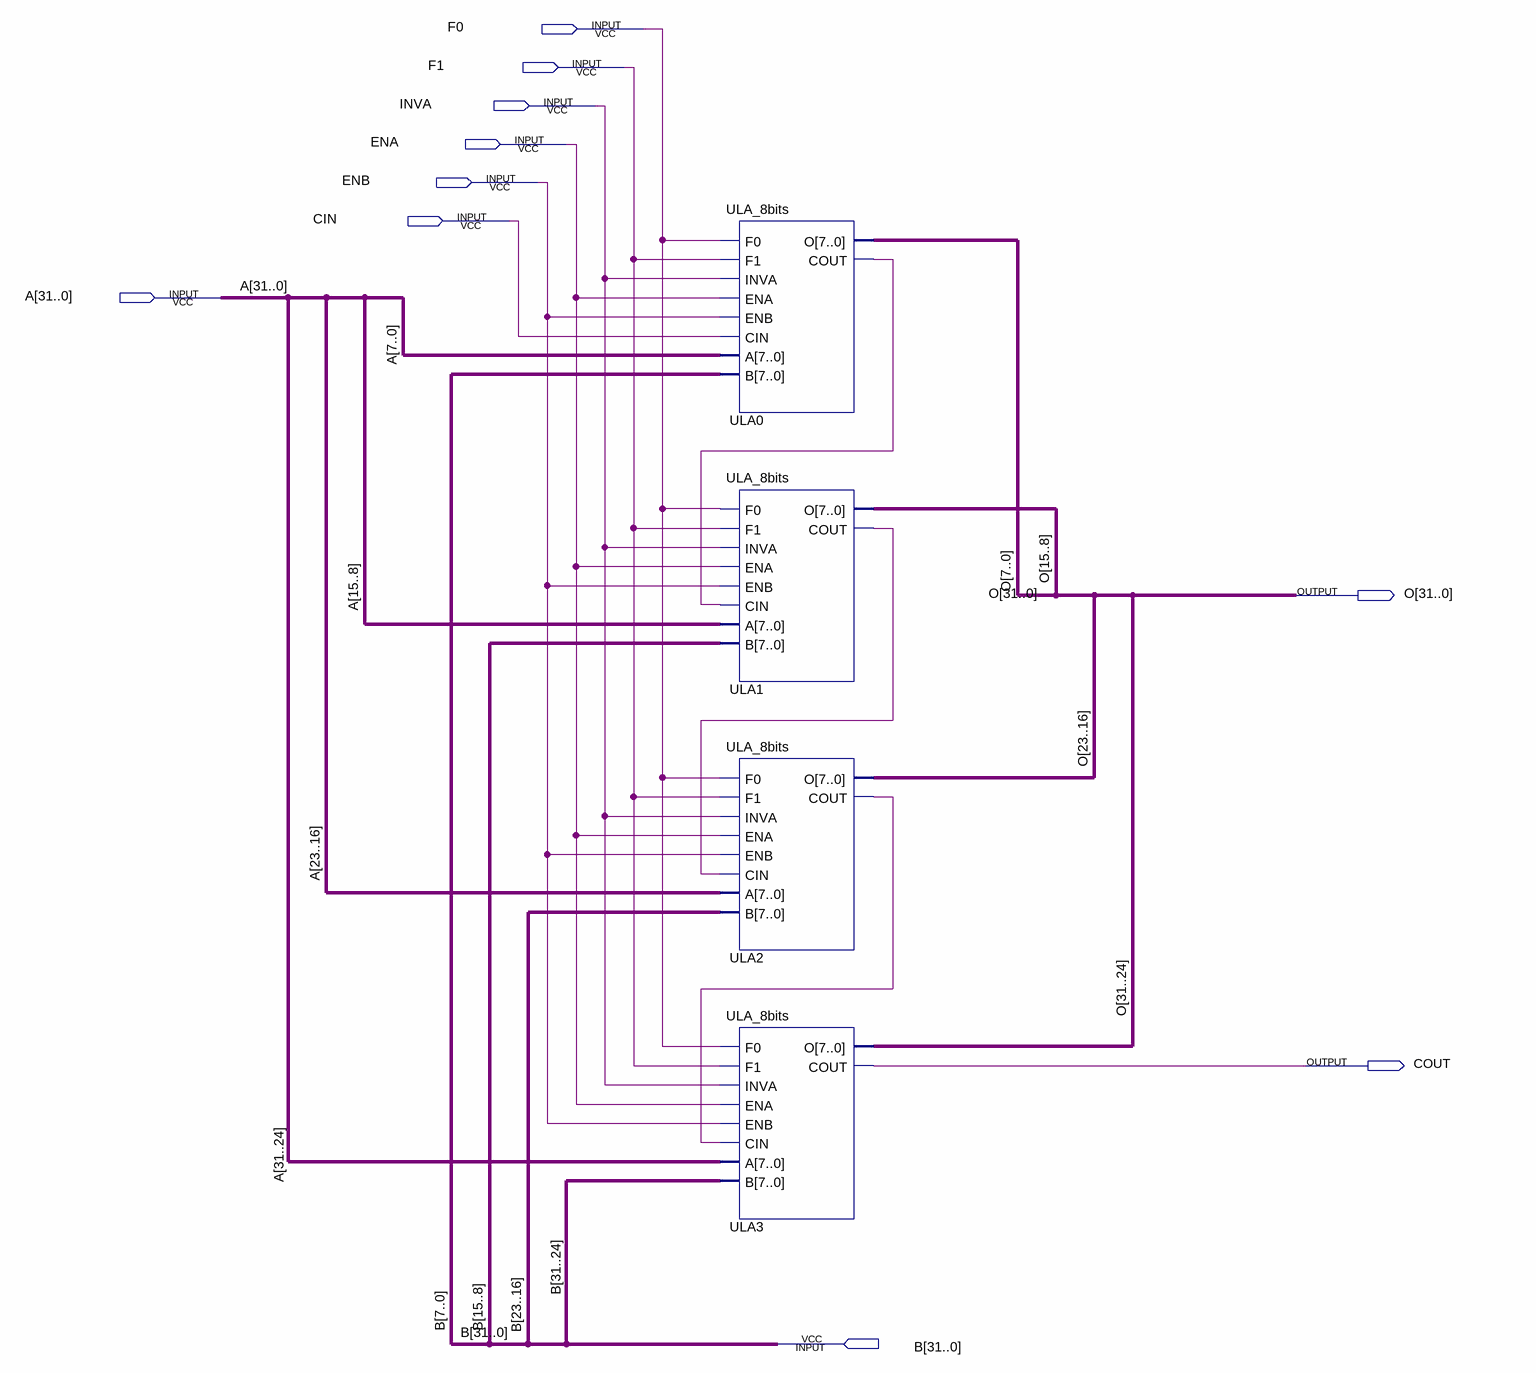
[diagram p0: schematic sheet]
// Quartus schematic ULA_32bits.bdf as structural Verilog: 4 symbols, 10 pins
module ULA_32bits (
  input  F0,
  input  F1,
  input  INVA,
  input  ENA,
  input  ENB,
  input  CIN,
  input  [31:0] A,
  input  [31:0] B,
  output [31:0] O,
  output COUT
);

  wire ULA0_cout, ULA1_cout, ULA2_cout;

  ULA_8bits ULA0 (
    .F0(F0), .F1(F1), .INVA(INVA), .ENA(ENA), .ENB(ENB), .CIN(CIN), .A(A[7:0]), .B(B[7:0]), .O(O[7:0]),
    .COUT(ULA0_cout));
  ULA_8bits ULA1 (
    .F0(F0), .F1(F1), .INVA(INVA), .ENA(ENA), .ENB(ENB), .CIN(ULA0_cout), .A(A[15:8]), .B(B[15:8]),
    .O(O[15:8]), .COUT(ULA1_cout));
  ULA_8bits ULA2 (
    .F0(F0), .F1(F1), .INVA(INVA), .ENA(ENA), .ENB(ENB), .CIN(ULA1_cout), .A(A[23:16]), .B(B[23:16]),
    .O(O[23:16]), .COUT(ULA2_cout));
  ULA_8bits ULA3 (
    .F0(F0), .F1(F1), .INVA(INVA), .ENA(ENA), .ENB(ENB), .CIN(ULA2_cout), .A(A[31:24]), .B(B[31:24]),
    .O(O[31:24]), .COUT(COUT));
endmodule
